# Altium schematic sheet LEDs.SchDoc
size A
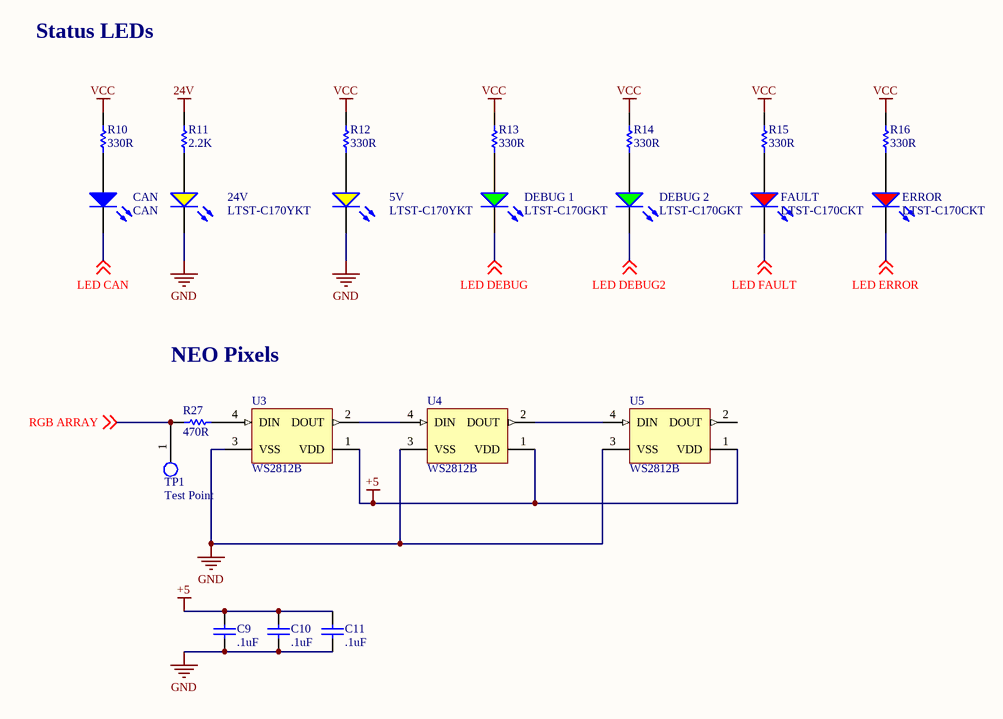
[diagram p0: LEDs.SchDoc]

## Parts
5V  LTST-C170YKT  [LTST-C170YKT_V]
24V  LTST-C170YKT  [LTST-C170YKT_V]
C9  .1uF  [CAPC0805(2012)130_N]
C10  .1uF  [CAPC0805(2012)130_N]
C11  .1uF  [CAPC0805(2012)130_N]
CAN  CAN  [0805_A]
DEBUG_1  LTST-C170GKT  [LTST-C170GKT_V]
DEBUG_2  LTST-C170GKT  [LTST-C170GKT_V]
ERROR  LTST-C170CKT  [LTST-C170CKT_V]
FAULT  LTST-C170CKT  [LTST-C170CKT_V]
R10  330R  [RESC0805(2012)_N]
R11  2.2K  [RESC0805(2012)_N]
R12  330R  [RESC0805(2012)_N]
R13  330R  [RESC0805(2012)_N]
R14  330R  [RESC0805(2012)_N]
R15  330R  [RESC0805(2012)_N]
R16  330R  [RESC0805(2012)_N]
R27  470R  [RESC0805(2012)_N]
TP1  Test Point  [Test Point Through-hole]
U3  WS2812B  [ADAI-WS2812B_V]
U4  WS2812B  [ADAI-WS2812B_V]
U5  WS2812B  [ADAI-WS2812B_V]

## Nets
24V: R11.2
+5: C9.2 C10.2 C11.2 U3.1(VDD) U4.1(VDD) U5.1(VDD)
GND: 5V.2(K) 24V.2(K) C9.1 C10.1 C11.1 U3.3(VSS) U4.3(VSS) U5.3(VSS)
VCC: R10.2 R12.2 R13.2 R14.2 R15.2 R16.2
LED CAN: CAN.1(K) ; off-sheet LED CAN
LED DEBUG: DEBUG_1.2(K) ; off-sheet LED DEBUG
LED DEBUG2: DEBUG_2.2(K) ; off-sheet LED DEBUG2
LED ERROR: ERROR.2(K) ; off-sheet LED ERROR
LED FAULT: FAULT.2(K) ; off-sheet LED FAULT
RGB ARRAY: R27.1 TP1.1 ; off-sheet RGB ARRAY
Net5V_1: 5V.1(A) R12.1
Net24V_1: 24V.1(A) R11.1
NetCAN_2: CAN.2(A) R10.1
NetDEBUG_1_1: DEBUG_1.1(A) R13.1
NetDEBUG_2_1: DEBUG_2.1(A) R14.1
NetERROR_1: ERROR.1(A) R16.1
NetFAULT_1: FAULT.1(A) R15.1
NetR27_2: R27.2 U3.4(DIN)
NetU3_2: U3.2(DOUT) U4.4(DIN)
NetU4_2: U4.2(DOUT) U5.4(DIN)

Not connected (* = marked no-connect by the designer): U5 2(DOUT)

## Notes on the sheet
- Status LEDs
- NEO Pixels

## Library data of the parts
5V 24V = CMP-1674-00003-5: LED Uni-Color Yellow, 60 mW, 80 mA, -55 to 85 degC, 2-Pin SMD, RoHS, Tape and Reel; Manufacturer: Lite-On; PackageReference: C170YKT; ComponentLink1Description: Manufacturer URL; ComponentLink1URL: http://www.us.liteon.com/; Mounting Technology: Surface Mount; Height: 1.1 mm; Mount: Surface Mount; Packaging: Tape and Reel; Length: 2 mm; RoHSCompliant: true; Colour: Yellow; Max Operating Temperature: 85 degC; Min Operating Temperature: -55 degC; DatasheetVersion: 03/2000; PackageDescription: 2-Pin Surface Mount Device, Body 2 x 1.25 mm; ComponentLink2URL: http://media.digikey.com/pdf/Data Sheets/Lite-On PDFs/LTST-C170YKT.pdf; Package Quantity: 3000; ComponentLink2Description: Datasheet; Pins: 2
C9-C11 = CMP-1036-02603-1: CAP 390pF 200V ±5% 0805 (2012 Metric) Thickness 1.3mm SMD; Case-Metric: 2012; Case-EIA: 0805; Tolerance: Â±5%; Max Thickness: 1.3 mm; Rated Voltage: 200 V; Technology: SMT; Value: 390pF
CAN = CMP-1426-00008-1: SMD mono-color Chip LED, WL-SMCW, Blue; Manufacturer: Wuerth Elektronik; PartNumber: 150080BS75000; Color: Blue; ComponentLink2URL: http://katalog.we-online.com/led/datasheet/150080BS75000.pdf; ComponentLink1URL: http://www.we-online.com; ComponentLink2Description: Datasheet; PackageReference: 0805_A; ComponentLink1Description: Manufacturer URL
DEBUG_1 DEBUG_2 = CMP-1674-00002-5: LED Uni-Color Green, 100 mW, 120 mA, -55 to 85 degC, 2-Pin SMD, RoHS, Tape and Reel; Manufacturer: Lite-On; PackageReference: C170GKT; ComponentLink1Description: Manufacturer URL; ComponentLink1URL: http://www.us.liteon.com/; Height: 1.1 mm; PackageDescription: 2-Pin Surface Mount Device, Body 2 x 1.25 mm; RoHSCompliant: true; Package Quantity: 1; Packaging: Tape and Reel; Mount: Surface Mount; Min Operating Temperature: -55 degC; DatasheetVersion: 03/2003; Max Operating Temperature: 85 degC; Pins: 2; Mounting Technology: Surface Mount; Length: 2 mm; Colour: Green; ComponentLink2URL: http://media.digikey.com/pdf/Data%20Sheets/Lite-On%20PDFs/LTST-C170GKT.pdf; ComponentLink2Description: Datasheet
ERROR FAULT = CMP-1674-00001-5: LED Uni-Color Red, 100 mW, 200 mA, -55 to 85 degC, 2-Pin SMD, RoHS, Tape and Reel; Manufacturer: Lite-On; ComponentLink1Description: Manufacturer URL; PackageReference: C170CKT; ComponentLink1URL: http://www.us.liteon.com/; Package Quantity: 3000; Packaging: Tape and Reel; Pins: 2; ComponentLink2URL: http://media.digikey.com/pdf/Data%20Sheets/Lite-On%20PDFs/LTST-C170CKT.pdf; Max Operating Temperature: 85 degC; Min Operating Temperature: -55 degC; Mounting Technology: Surface Mount; Mount: Surface Mount; Length: 2 mm; ComponentLink2Description: Datasheet; DatasheetVersion: 03/2003; Height: 1.1 mm; PackageDescription: 2-Pin Surface Mount Device, Body 2 x 1.25 mm; RoHSCompliant: true; Colour: Red
R10-R16 R27 = 120R 5% 0805: 120R 0.125W 5% 0805 (2012 Metric)  SMD; Case-Metric: 2012; Value: 120.00 Ohm; Case-EIA: 0805; Tolerance: 5 %; Technology: SMT; Power: 0.125 W
U3-U5 = CMP-1740-00005-1: Intelligent Control LED Integrated Light Source, 3.5 to 5.3 V, -25 to 80 degC, 4-Pin SMD, RoHS, Bulk; Case\Package: Radial; Shielding: Unshielded; Current Rating: 240 mA; Tolerance: 10%; Mount: Through Hole; Max Operating Temperature: 125 degC; Radiation Hardening: No; Length: 12.2 mm; Min Operating Temperature: -55 degC; ComponentLink1URL: https://www.adafruit.com/; Packaging: Bulk; Lead Pitch: 5 mm; RoHSCompliant: true; Pins: 2; Package Quantity: 200; ComponentLink2URL: https://cdn-shop.adafruit.com/datasheets/WS2812B.pdf; ComponentLink2Description: Datasheet; PackageDescription: 4-Pin Surface Mount Device, Body 5 x 5 mm, Pitch 3.3 mm; PackageReference: WS2812B; Height: 12.2 mm; REACH SVHC: No SVHC; ComponentLink1Description: Manufacturer URL; DatasheetVersion: May-13